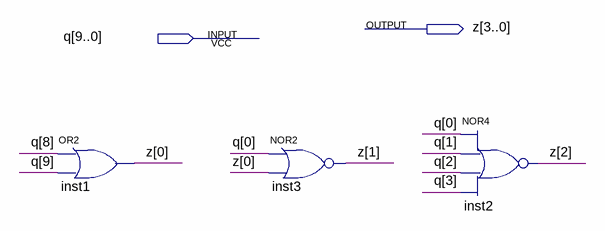
[diagram p0: schematic sheet]
// Quartus schematic logic_chain.bdf as structural Verilog: 3 symbols, 2 pins
module logic_chain (
  input  [9:0] q,
  output [3:0] z
);

  or inst1 (z[0], q[8], q[9]);
  nor inst3 (z[1], q[0], z[0]);
  nor inst2 (z[2], q[0], q[1], q[2], q[3]);
endmodule
